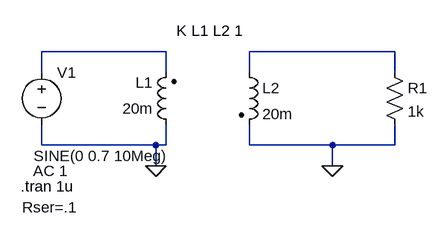
[diagram p0: schematic INVERTER FOR GILBERT CELL INPUTS.asc]
INVERTER FOR GILBERT CELL INPUTS.asc, the LTspice schematic file:
Version 4
SHEET 1 880 680
WIRE 144 64 -48 64
WIRE 496 64 272 64
WIRE -48 96 -48 64
WIRE 144 96 144 64
WIRE 272 96 272 64
WIRE 496 96 496 64
WIRE -48 208 -48 176
WIRE 128 208 -48 208
WIRE 144 208 144 176
WIRE 144 208 128 208
WIRE 272 208 272 176
WIRE 400 208 272 208
WIRE 496 208 496 176
WIRE 496 208 400 208
WIRE 128 240 128 208
WIRE 400 240 400 208
FLAG 128 240 0
FLAG 400 240 0
SYMBOL ind2 160 192 R180
WINDOW 0 36 80 Left 2
WINDOW 3 36 40 Left 2
SYMATTR InstName L1
SYMATTR Value 20m
SYMATTR Type ind
SYMBOL ind2 256 80 R0
SYMATTR InstName L2
SYMATTR Value 20m
SYMATTR Type ind
SYMBOL voltage -48 80 R0
WINDOW 3 -12 145 Left 2
WINDOW 123 -13 168 Left 2
WINDOW 39 -30 224 Left 2
SYMATTR InstName V1
SYMATTR Value SINE(0 0.7 10Meg)
SYMATTR Value2 AC 1
SYMATTR SpiceLine Rser=.1
SYMBOL res 480 80 R0
SYMATTR InstName R1
SYMATTR Value 1k
TEXT 160 32 Left 2 !K L1 L2 1
TEXT -80 272 Left 2 !.tran 1u

The netlist it stands for:
* INVERTER FOR GILBERT CELL INPUTS.asc
L1 0 N001 20m
L2 N002 0 20m
V1 N001 0 SINE(0 0.7 10Meg) AC 1 Rser=.1
R1 N002 0 1k
K L1 L2 1
.tran 1u
.backanno
.end